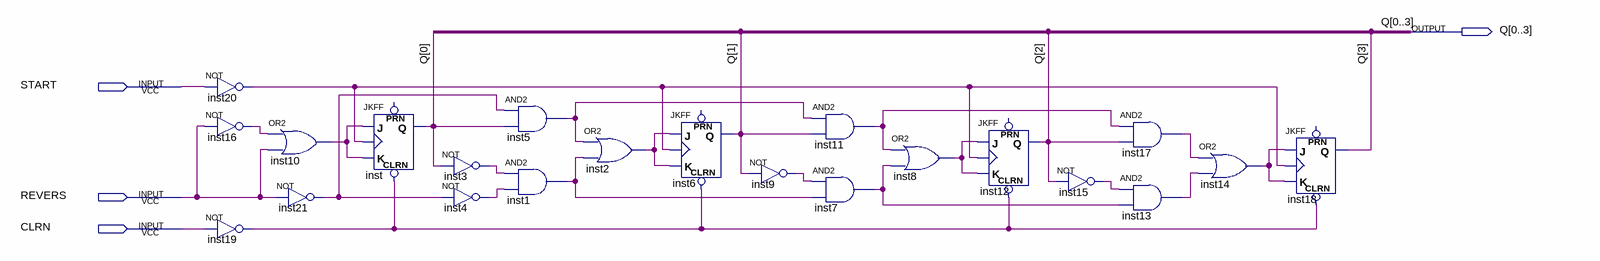
[diagram p0: schematic sheet]
// Quartus schematic reversff.bdf as structural Verilog: 22 symbols, 4 pins
module reversff (
  input  START,
  input  REVERS,
  input  CLRN,
  output [0:3] Q
);

  wire inst1_out, inst2_out, inst3_out, inst4_out, inst5_out, inst7_out, inst8_out, inst9_out, inst10_out,
       inst11_out, inst13_out, inst14_out, inst15_out, inst16_out, inst17_out, inst19_out, inst20_out,
       inst21_out;

  not inst20 (inst20_out, START);
  not inst16 (inst16_out, REVERS);
  not inst19 (inst19_out, CLRN);
  or inst10 (inst10_out, inst16_out, REVERS);
  not inst21 (inst21_out, REVERS);
  JKFF inst (.CLRN(inst19_out), .K(inst10_out), .J(inst10_out), .CLK(inst20_out), .Q(Q[0]));  // open: PRN
  not inst3 (inst3_out, Q[0]);
  not inst4 (inst4_out, inst21_out);
  and inst5 (inst5_out, inst21_out, Q[0]);
  and inst1 (inst1_out, inst3_out, inst4_out);
  or inst2 (inst2_out, inst5_out, inst1_out);
  JKFF inst6 (.CLRN(inst19_out), .K(inst2_out), .J(inst2_out), .CLK(inst20_out), .Q(Q[1]));  // open: PRN
  not inst9 (inst9_out, Q[1]);
  and inst11 (inst11_out, inst5_out, Q[1]);
  and inst7 (inst7_out, inst9_out, inst1_out);
  or inst8 (inst8_out, inst11_out, inst7_out);
  JKFF inst12 (.CLRN(inst19_out), .K(inst8_out), .J(inst8_out), .CLK(inst20_out), .Q(Q[2]));  // open: PRN
  not inst15 (inst15_out, Q[2]);
  and inst17 (inst17_out, inst11_out, Q[2]);
  and inst13 (inst13_out, inst15_out, inst7_out);
  or inst14 (inst14_out, inst17_out, inst13_out);
  JKFF inst18 (.CLRN(inst19_out), .K(inst14_out), .J(inst14_out), .CLK(inst20_out), .Q(Q[3]));  // open: PRN
endmodule
